# Altium schematic sheet STM32F103ZET6-double.SchDoc
size Legal; SheetNumber: 1; SheetTotal: 1
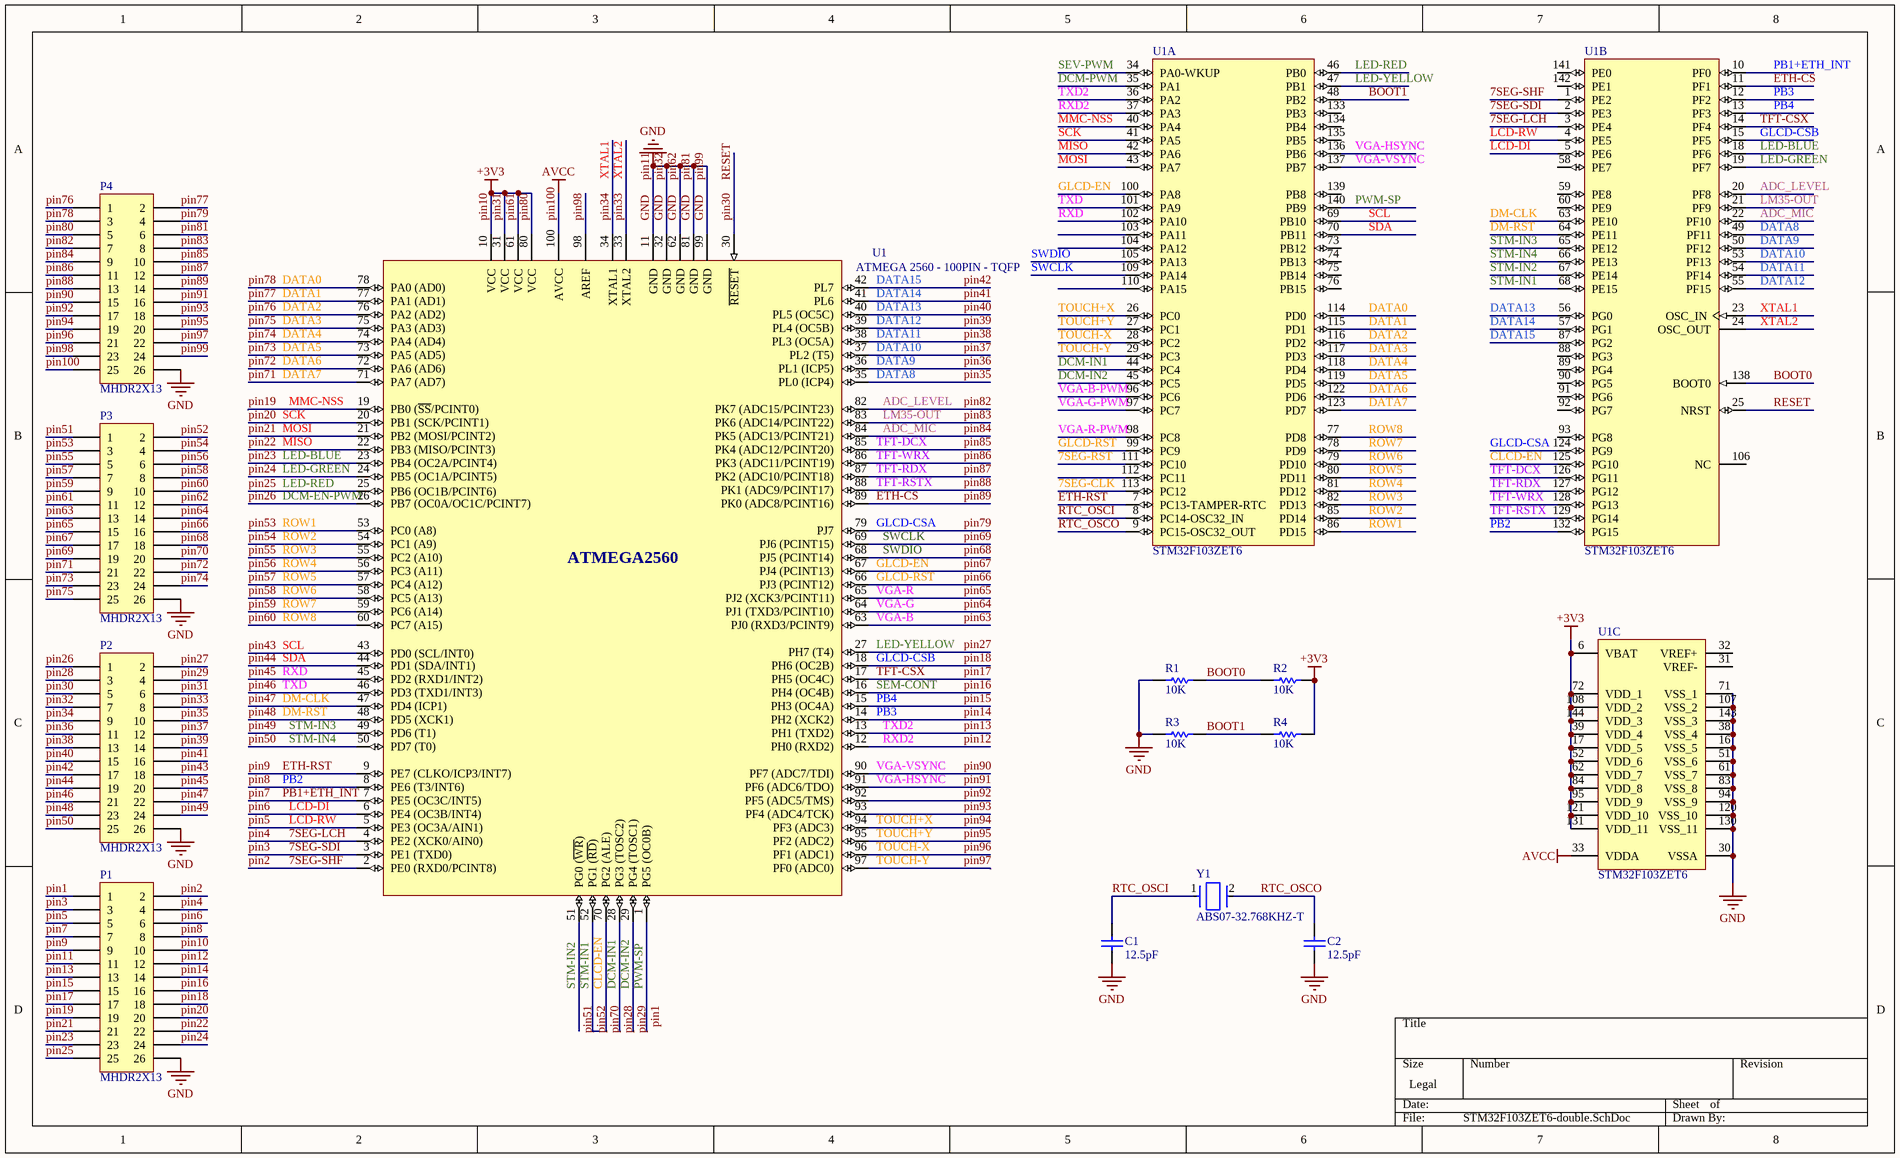
[diagram p0: STM32F103ZET6-double.SchDoc]

## Parts
(Parts that share a designator on the sheet are numbered #1, #2 ... from top to bottom, then left to right.)
C1  12.5pF  [SMD_R0805]
C2  12.5pF  [SMD_R0805]
P1  MHDR2X13  [HED-2mm-13X2]
P2  MHDR2X13  [HED-2mm-13X2]
P3  MHDR2X13  [HED-2mm-13X2]
P4  MHDR2X13  [HED-2mm-13X2]
R1  10K  [SMD_R0805]
R2  10K  [SMD_R0805]
R3  10K  [SMD_R0805]
R4  10K  [SMD_R0805]
U1#1  STM32F103ZET6  [STM-LQFP144_V]  (parts A,B,C of 3)
U1#2  ATMEGA 2560 - 100PIN - TQFP  [Quad100]  (graphical)
Y1  ABS07-32.768KHZ-T  [FP-ABS07-MFG]

## Nets
GND: C1.1 C2.1 P1.11 P1.26 P2.7 P2.26 P3.12 P3.26 P4.6 P4.24 P4.26 R1.1 R3.1 U1#1.16(VSS_5) U1#1.30(VSSA) U1#1.38(VSS_4) U1#1.51(VSS_6) U1#1.61(VSS_7) U1#1.71(VSS_1) U1#1.83(VSS_8) U1#1.94(VSS_9) U1#1.107(VSS_2) U1#1.120(VSS_10) U1#1.130(VSS_11) U1#1.143(VSS_3) U1#2.11(GND) U1#2.32(GND) U1#2.62(GND) U1#2.81(GND) U1#2.99(GND)  [also labelled pin11, pin32, pin62, pin81, pin99]
pin10: P1.10 P2.6 P3.11 P4.5 R2.2 R4.2 U1#1.6(VBAT) U1#1.17(VDD_5) U1#1.39(VDD_4) U1#1.52(VDD_6) U1#1.62(VDD_7) U1#1.72(VDD_1) U1#1.84(VDD_8) U1#1.95(VDD_9) U1#1.108(VDD_2) U1#1.121(VDD_10) U1#1.131(VDD_11) U1#1.144(VDD_3) U1#2.10(VCC) U1#2.31(VCC) U1#2.61(VCC) U1#2.80(VCC)  [also labelled +3V3, pin31, pin61, pin80]
pin100: P4.25 U1#1.33(VDDA) U1#2.100(AVCC)  [also labelled AVCC]
7SEG-CLK: U1#1.113(PC12)
7SEG-LCH: P1.4 U1#1.3(PE4) U1#2.4(PE2_(XCK0/AIN0))  [also labelled pin4]
7SEG-RST: U1#1.111(PC10)
7SEG-SDI: P1.3 U1#1.2(PE3) U1#2.3(PE1_(TXD0))  [also labelled pin3]
7SEG-SHF: P1.2 U1#1.1(PE2) U1#2.2(PE0_(RXD0/PCINT8))  [also labelled pin2]
ADC_LEVEL: P4.7 U1#1.20(PF8) U1#2.82(PK7_(ADC15/PCINT23))  [also labelled pin82]
ADC_MIC: P4.9 U1#1.22(PF10) U1#2.84(PK5_(ADC13/PCINT21))  [also labelled pin84]
BOOT0: R1.2 R2.1 U1#1.138(BOOT0)
BOOT1: R3.2 R4.1 U1#1.48(PB2)
CLCD-EN: P3.20 U1#1.125(PG10) U1#2.70(PG2_(ALE))  [also labelled pin70]
DATA0: P4.3 U1#1.114(PD0) U1#2.78(PA0_(AD0))  [also labelled pin78]
DATA1: P4.2 U1#1.115(PD1) U1#2.77(PA1_(AD1))  [also labelled pin77]
DATA2: P4.1 U1#1.116(PD2) U1#2.76(PA2_(AD2))  [also labelled pin76]
DATA3: P3.25 U1#1.117(PD3) U1#2.75(PA3_(AD3))  [also labelled pin75]
DATA4: P3.24 U1#1.118(PD4) U1#2.74(PA4_(AD4))  [also labelled pin74]
DATA5: P3.23 U1#1.119(PD5) U1#2.73(PA5_(AD5))  [also labelled pin73]
DATA6: P3.22 U1#1.122(PD6) U1#2.72(PA6_(AD6))  [also labelled pin72]
DATA7: P3.21 U1#1.123(PD7) U1#2.71(PA7_(AD7))  [also labelled pin71]
DATA8: P2.10 U1#1.49(PF11) U1#2.35(PL0_(ICP4))  [also labelled pin35]
DATA9: P2.11 U1#1.50(PF12) U1#2.36(PL1_(ICP5))  [also labelled pin36]
DATA10: P2.12 U1#1.53(PF13) U1#2.37(PL2_(T5))  [also labelled pin37]
DATA11: P2.13 U1#1.54(PF14) U1#2.38(PL3_(OC5A))  [also labelled pin38]
DATA12: P2.14 U1#1.55(PF15) U1#2.39(PL4_(OC5B))  [also labelled pin39]
DATA13: P2.15 U1#1.56(PG0) U1#2.40(PL5_(OC5C))  [also labelled pin40]
DATA14: P2.16 U1#1.57(PG1) U1#2.41(PL6)  [also labelled pin41]
DATA15: P2.17 U1#1.87(PG2) U1#2.42(PL7)  [also labelled pin42]
DCM-EN-PWM: P2.1 U1#2.26(PB7_(OC0A/OC1C/PCINT7))  [also labelled pin26]
DCM-IN1: P2.3 U1#1.44(PC4) U1#2.28(PG3_(TOSC2))  [also labelled pin28]
DCM-IN2: P2.4 U1#1.45(PC5) U1#2.29(PG4_(TOSC1))  [also labelled pin29]
DCM-PWM: U1#1.35(PA1)
DM-CLK: P2.22 U1#1.63(PE10) U1#2.47(PD4_(ICP1))  [also labelled pin47]
DM-RST: P2.23 U1#1.64(PE11) U1#2.48(PD5_(XCK1))  [also labelled pin48]
ETH-CS: P4.14 U1#1.11(PF1) U1#2.89(PK0_(ADC8/PCINT16))  [also labelled pin89]
ETH-RST: P1.9 U1#1.7(PC13-TAMPER-RTC) U1#2.9(PE7_(CLKO/ICP3/INT7))  [also labelled pin9]
GLCD-CSA: P4.4 U1#1.124(PG9) U1#2.79(PJ7)  [also labelled pin79]
GLCD-CSB: P1.18 U1#1.15(PF5) U1#2.18(PH6_(OC2B))  [also labelled pin18]
GLCD-EN: P3.17 U1#1.100(PA8) U1#2.67(PJ4_(PCINT13))  [also labelled pin67]
GLCD-RST: P3.16 U1#1.99(PC9) U1#2.66(PJ3_(PCINT12))  [also labelled pin66]
LCD-DI: P1.6 U1#1.5(PE6) U1#2.6(PE4_(OC3B/INT4))  [also labelled pin6]
LCD-RW: P1.5 U1#1.4(PE5) U1#2.5(PE3_(OC3A/AIN1))  [also labelled pin5]
LED-BLUE: P1.23 U1#1.18(PF6) U1#2.23(PB4_(OC2A/PCINT4))  [also labelled pin23]
LED-GREEN: P1.24 U1#1.19(PF7) U1#2.24(PB5_(OC1A/PCINT5))  [also labelled pin24]
LED-RED: P1.25 U1#1.46(PB0) U1#2.25(PB6_(OC1B/PCINT6))  [also labelled pin25]
LED-YELLOW: P2.2 U1#1.47(PB1) U1#2.27(PH7_(T4))  [also labelled pin27]
LM35-OUT: P4.8 U1#1.21(PF9) U1#2.83(PK6_(ADC14/PCINT22))  [also labelled pin83]
MISO: P1.22 U1#1.42(PA6) U1#2.22(PB3_(MISO/PCINT3))  [also labelled pin22]
MMC-NSS: P1.19 U1#1.40(PA4) U1#2.19(PB0_(~{SS}/PCINT0))  [also labelled pin19]
MOSI: P1.21 U1#1.43(PA7) U1#2.21(PB2_(MOSI/PCINT2))  [also labelled pin21]
PB1+ETH_INT: P1.7 U1#1.10(PF0) U1#2.7(PE5_(OC3C/INT5))  [also labelled pin7]
PB2: P1.8 U1#1.132(PG15) U1#2.8(PE6_(T3/INT6))  [also labelled pin8]
PB3: P1.14 U1#1.12(PF2) U1#2.14(PH2_(XCK2))  [also labelled pin14]
PB4: P1.15 U1#1.13(PF3) U1#2.15(PH3_(OC4A))  [also labelled pin15]
pin1: P1.1 U1#1.140(PB9) U1#2.1(PG5_(OC0B))  [also labelled PWM-SP]
pin12: P1.12 U1#1.37(PA3) U1#2.12(PH0_(RXD2))  [also labelled RXD2]
pin13: P1.13 U1#1.36(PA2) U1#2.13(PH1_(TXD2))  [also labelled TXD2]
pin16: P1.16 U1#2.16(PH4_(OC4B))  [also labelled SEM-CONT]
pin17: P1.17 U1#1.14(PF4) U1#2.17(PH5_(OC4C))  [also labelled TFT-CSX]
pin20: P1.20 U1#1.41(PA5) U1#2.20(PB1_(SCK/PCINT1))  [also labelled SCK]
pin30: P2.5 U1#1.25(NRST) U1#2.30(~{RESET})  [also labelled RESET]
pin33: P2.8 U1#1.24(OSC_OUT) U1#2.33(XTAL2)  [also labelled XTAL2]
pin34: P2.9 U1#1.23(OSC_IN) U1#2.34(XTAL1)  [also labelled XTAL1]
pin43: P2.18 U1#1.69(PB10) U1#2.43(PD0_(SCL/INT0))  [also labelled SCL]
pin44: P2.19 U1#1.70(PB11) U1#2.44(PD1_(SDA/INT1))  [also labelled SDA]
pin45: P2.20 U1#1.102(PA10) U1#2.45(PD2_(RXD1/INT2))  [also labelled RXD]
pin46: P2.21 U1#1.101(PA9) U1#2.46(PD3_(TXD1/INT3))  [also labelled TXD]
pin49: P2.24 U1#1.65(PE12) U1#2.49(PD6_(T1))  [also labelled STM-IN3]
pin50: P2.25 U1#1.66(PE13) U1#2.50(PD7_(T0))  [also labelled STM-IN4]
pin51: P3.1 U1#1.67(PE14) U1#2.51(PG0_(~{WR}))  [also labelled STM-IN2]
pin52: P3.2 U1#1.68(PE15) U1#2.52(PG1_(~{RD}))  [also labelled STM-IN1]
pin53: P3.3 U1#1.86(PD15) U1#2.53(PC0_(A8))  [also labelled ROW1]
pin54: P3.4 U1#1.85(PD14) U1#2.54(PC1_(A9))  [also labelled ROW2]
pin55: P3.5 U1#1.82(PD13) U1#2.55(PC2_(A10))  [also labelled ROW3]
pin56: P3.6 U1#1.81(PD12) U1#2.56(PC3_(A11))  [also labelled ROW4]
pin57: P3.7 U1#1.80(PD11) U1#2.57(PC4_(A12))  [also labelled ROW5]
pin58: P3.8 U1#1.79(PD10) U1#2.58(PC5_(A13))  [also labelled ROW6]
pin59: P3.9 U1#1.78(PD9) U1#2.59(PC6_(A14))  [also labelled ROW7]
pin60: P3.10 U1#1.77(PD8) U1#2.60(PC7_(A15))  [also labelled ROW8]
pin63: P3.13 U1#2.63(PJ0_(RXD3/PCINT9))  [also labelled VGA-B]
pin64: P3.14 U1#2.64(PJ1_(TXD3/PCINT10))  [also labelled VGA-G]
pin65: P3.15 U1#2.65(PJ2_(XCK3/PCINT11))  [also labelled VGA-R]
pin68: P3.18 U1#1.105(PA13) U1#2.68(PJ5_(PCINT14))  [also labelled SWDIO]
pin69: P3.19 U1#1.109(PA14) U1#2.69(PJ6_(PCINT15))  [also labelled SWCLK]
pin85: P4.10 U1#1.126(PG11) U1#2.85(PK4_(ADC12/PCINT20))  [also labelled TFT-DCX]
pin86: P4.11 U1#1.128(PG13) U1#2.86(PK3_(ADC11/PCINT19))  [also labelled TFT-WRX]
pin87: P4.12 U1#1.127(PG12) U1#2.87(PK2_(ADC10/PCINT18))  [also labelled TFT-RDX]
pin88: P4.13 U1#1.129(PG14) U1#2.88(PK1_(ADC9/PCINT17))  [also labelled TFT-RSTX]
pin90: P4.15 U1#1.137(PB7) U1#2.90(PF7_(ADC7/TDI))  [also labelled VGA-VSYNC]
pin91: P4.16 U1#1.136(PB6) U1#2.91(PF6_(ADC6/TDO))  [also labelled VGA-HSYNC]
pin92: P4.17 U1#2.92(PF5_(ADC5/TMS))
pin93: P4.18 U1#2.93(PF4_(ADC4/TCK))
pin94: P4.19 U1#1.26(PC0) U1#2.94(PF3_(ADC3))  [also labelled TOUCH+X]
pin95: P4.20 U1#1.27(PC1) U1#2.95(PF2_(ADC2))  [also labelled TOUCH+Y]
pin96: P4.21 U1#1.28(PC2) U1#2.96(PF1_(ADC1))  [also labelled TOUCH-X]
pin97: P4.22 U1#1.29(PC3) U1#2.97(PF0_(ADC0))  [also labelled TOUCH-Y]
pin98: P4.23 U1#2.98(AREF)
RTC_OSCI: C1.2 U1#1.8(PC14-OSC32_IN) Y1.1
RTC_OSCO: C2.2 U1#1.9(PC15-OSC32_OUT) Y1.2
SEV-PWM: U1#1.34(PA0-WKUP)
VGA-B-PWM: U1#1.96(PC6)
VGA-G-PWM: U1#1.97(PC7)
VGA-R-PWM: U1#1.98(PC8)

Not connected (* = marked no-connect by the designer): U1#1 31(VREF-) 32(VREF+) 58(PE7) 59(PE8) 60(PE9) 73(PB12) 74(PB13) 75(PB14) 76(PB15) 88(PG3) 89(PG4) 90(PG5) 91(PG6) 92(PG7) 93(PG8) 103(PA11) 104(PA12) 106(NC) 110(PA15) 112(PC11) 133(PB3) 134(PB4) 135(PB5) 139(PB8) 141(PE0) 142(PE1)

## Notes on the sheet
- (in symbol ATMEGA 2560) ATMEGA2560

## Library data of the parts
C1 C2 = Cap: Capacitor; Published: 8-Jun-2000; LatestRevisionDate: 17-Jul-2002; LatestRevisionNote: Re-released for DXP Platform.; PackageReference: RAD-0.3; Publisher: Altium Limited; Value: 12.5pF
P1-P4 = MHDR2X13: Header, 13-Pin, Dual row; LatestRevisionDate: 17-Jul-2002; LatestRevisionNote: Re-released for DXP Platform.; Publisher: Altium Limited
R1-R4 = Res1: Resistor; Published: 8-Jun-2000; LatestRevisionDate: 17-Jul-2002; LatestRevisionNote: Re-released for DXP Platform.; PackageReference: AXIAL-0.3; Publisher: Altium Limited; Value: 10K
U1#1 = CMP-0237-00176-3: ARM Cortex-M3 32-bit MCU, 512 KB Flash, 64 KB Internal RAM, 112 I/Os, 144-pin LQFP, -40 to 85 degC, Tray; D/A Converter: 2x12-bit (2 Channel); FLASH Size (Prog) (kB): 512; Internal RAM Size (kB): 64; I/Os (High Current): 112; Supply Voltage(Vcc) min (V): 2; Operating Frequency(F) (Processor speed) (MHz): 72; A/D Converter: 3x12-bit (21 Channel); ComponentLink2Description: Datasheet; PackageReference: LQFP144; ComponentLink3URL: http://www.st.com/st-web-ui/static/active/en/resource/technical/document/datasheet/DM00037051.pdf; Mounting Technology: Surface Mount; ComponentLink1URL: http://www.st.com/web/en/home.html; ComponentLink2URL: http://www.st.com/st-web-ui/static/active/en/resource/technical/document/datasheet/CD00191185.pdf; PackageVersion: Rev. 4, 06/2013; DatasheetVersion: Rev. 8; PartNumber: STM32F103ZET6; ComponentLink1Description: Manufacturer URL; PackageDescription: 144-Pin Low Profile Quad Flat Package, 20 x 20 mm Body, 0.5 mm Pitch; Core: ARM Cortex-M3; ComponentLink3Description: Package Specification; Packing: Tray
U1#2 = ATMEGA 2560
Y1 = CMP-0447-00001-4: Crystal 32.768kHz ±20ppm (Tol) 12.5pF FUND 70kΩ 2-Pin CSMD T/R; ESR (Equivalent Series Resistance): 70kR; Radiation Hardening: No; Frequency: 32.768kHz; Length: 3.2mm; Max Operating Temperature: 85°C; Number of Pins: 2; Series: ABS07; Min Operating Temperature: -40°C; Frequency Tolerance: 20ppm; Packaging: Tape and Reel; Height: 0.9mm; Width: 1.5mm; Depth: 1.5mm; Load Capacitance: 12.5pF; RoHS Compliant: Yes; Tolerance: 20ppm; Termination: SMD/SMT; Lead Free: Lead Free; Series Resistance: 70kR; REACH SVHC: No SVHC; Case/Package: CSMD; Operating Frequency: 32.768 kHz; Package Quantity: 3000